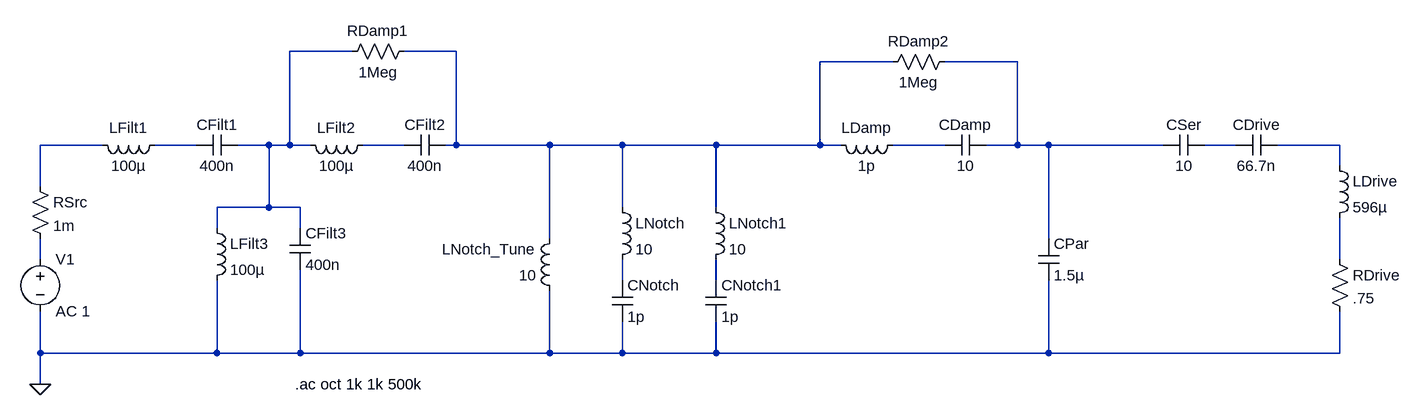
[diagram p0: schematic Filter_Archetype_Damped_3.asc]
Filter_Archetype_Damped_3.asc, the LTspice schematic file:
Version 4
SHEET 1 1972 680
WIRE 352 -80 256 -80
WIRE 512 -80 432 -80
WIRE 1184 -64 1072 -64
WIRE 1376 -64 1264 -64
WIRE -32 64 -128 64
WIRE 112 64 48 64
WIRE 224 64 176 64
WIRE 256 64 256 -80
WIRE 256 64 224 64
WIRE 288 64 256 64
WIRE 432 64 368 64
WIRE 512 64 512 -80
WIRE 512 64 496 64
WIRE 656 64 512 64
WIRE 768 64 656 64
WIRE 912 64 768 64
WIRE 1072 64 1072 -64
WIRE 1072 64 912 64
WIRE 1104 64 1072 64
WIRE 1264 64 1184 64
WIRE 1376 64 1376 -64
WIRE 1376 64 1328 64
WIRE 1424 64 1376 64
WIRE 1600 64 1424 64
WIRE 1712 64 1664 64
WIRE 1872 64 1776 64
WIRE 1872 96 1872 64
WIRE -128 128 -128 64
WIRE 224 160 224 64
WIRE 224 160 144 160
WIRE 272 160 224 160
WIRE 768 160 768 64
WIRE 912 160 912 64
WIRE 144 192 144 160
WIRE 272 192 272 160
WIRE 656 208 656 64
WIRE 1424 208 1424 64
WIRE -128 240 -128 208
WIRE 1872 240 1872 176
WIRE 768 272 768 240
WIRE 912 272 912 240
WIRE -128 384 -128 320
WIRE 144 384 144 272
WIRE 144 384 -128 384
WIRE 272 384 272 256
WIRE 272 384 144 384
WIRE 656 384 656 288
WIRE 656 384 272 384
WIRE 768 384 768 336
WIRE 768 384 656 384
WIRE 912 384 912 336
WIRE 912 384 768 384
WIRE 1424 384 1424 272
WIRE 1424 384 912 384
WIRE 1872 384 1872 320
WIRE 1872 384 1424 384
WIRE -128 432 -128 384
FLAG -128 432 0
SYMBOL voltage -128 224 R0
WINDOW 123 0 0 Left 0
WINDOW 39 0 0 Left 0
SYMATTR InstName V1
SYMATTR Value AC 1
SYMBOL ind 64 48 R90
WINDOW 0 5 56 VBottom 2
WINDOW 3 32 56 VTop 2
SYMATTR InstName LFilt1
SYMATTR Value 100µ
SYMATTR SpiceLine Rser=100m
SYMBOL cap 176 48 R90
WINDOW 0 0 32 VBottom 2
WINDOW 3 32 32 VTop 2
SYMATTR InstName CFilt1
SYMATTR Value 400n
SYMBOL res -144 112 R0
SYMATTR InstName RSrc
SYMATTR Value 1m
SYMBOL ind 384 48 R90
WINDOW 0 5 56 VBottom 2
WINDOW 3 32 56 VTop 2
SYMATTR InstName LFilt2
SYMATTR Value 100µ
SYMATTR SpiceLine Rser=100m
SYMBOL cap 496 48 R90
WINDOW 0 0 32 VBottom 2
WINDOW 3 32 32 VTop 2
SYMATTR InstName CFilt2
SYMATTR Value 400n
SYMBOL ind 128 176 R0
SYMATTR InstName LFilt3
SYMATTR Value 100µ
SYMATTR SpiceLine Rser=100m
SYMBOL cap 256 192 R0
SYMATTR InstName CFilt3
SYMATTR Value 400n
SYMBOL ind 752 144 R0
SYMATTR InstName LNotch
SYMATTR Value 10
SYMBOL cap 752 272 R0
SYMATTR InstName CNotch
SYMATTR Value 1p
SYMBOL ind 672 304 R180
WINDOW 0 36 80 Left 2
WINDOW 3 36 40 Left 2
SYMATTR InstName LNotch_Tune
SYMATTR Value 10
SYMBOL cap 1408 208 R0
SYMATTR InstName CPar
SYMATTR Value 1.5µ
SYMBOL cap 1664 48 R90
WINDOW 0 0 32 VBottom 2
WINDOW 3 32 32 VTop 2
SYMATTR InstName CSer
SYMATTR Value 10
SYMBOL cap 1776 48 R90
WINDOW 0 0 32 VBottom 2
WINDOW 3 32 32 VTop 2
SYMATTR InstName CDrive
SYMATTR Value 66.7n
SYMBOL ind 1856 80 R0
SYMATTR InstName LDrive
SYMATTR Value 596µ
SYMBOL res 1856 224 R0
SYMATTR InstName RDrive
SYMATTR Value .75
SYMBOL res 448 -96 R90
WINDOW 0 0 56 VBottom 2
WINDOW 3 32 56 VTop 2
SYMATTR InstName RDamp1
SYMATTR Value 1Meg
SYMBOL ind 1200 48 R90
WINDOW 0 5 56 VBottom 2
WINDOW 3 32 56 VTop 2
SYMATTR InstName LDamp
SYMATTR Value 1p
SYMBOL cap 1328 48 R90
WINDOW 0 0 32 VBottom 2
WINDOW 3 32 32 VTop 2
SYMATTR InstName CDamp
SYMATTR Value 10
SYMBOL res 1280 -80 R90
WINDOW 0 0 56 VBottom 2
WINDOW 3 32 56 VTop 2
SYMATTR InstName RDamp2
SYMATTR Value 1Meg
SYMBOL ind 896 144 R0
SYMATTR InstName LNotch1
SYMATTR Value 10
SYMBOL cap 896 272 R0
SYMATTR InstName CNotch1
SYMATTR Value 1p
TEXT 264 432 Left 2 !.ac oct 1k 1k 500k

The netlist it stands for:
* Filter_Archetype_Damped_3.asc
V1 N010 0 AC 1
LFilt1 N005 N004 100µ Rser=100m
CFilt1 N001 N005 400n
RSrc N004 N010 1m
LFilt2 N006 N001 100µ Rser=100m
CFilt2 N002 N006 400n
LFilt3 N001 0 100µ Rser=100m
CFilt3 N001 0 400n
LNotch N002 N012 10
CNotch N012 0 1p
LNotch_Tune 0 N002 10
CPar N003 0 1.5µ
CSer N008 N003 10
CDrive N009 N008 66.7n
LDrive N009 N011 596µ
RDrive N011 0 .75
RDamp1 N002 N001 1Meg
LDamp N007 N002 1p
CDamp N003 N007 10
RDamp2 N003 N002 1Meg
LNotch1 N002 N013 10
CNotch1 N013 0 1p
.ac oct 1k 1k 500k
.backanno
.end